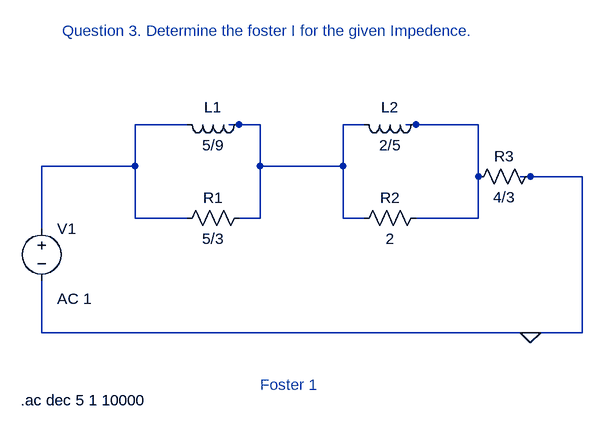
[diagram p0: schematic 3_Dheerendra_23EE019_Network_Synthesis.asc]
3_Dheerendra_23EE019_Network_Synthesis.asc, the LTspice schematic file:
Version 4
SHEET 1 880 680
WIRE 64 112 -16 112
WIRE 144 112 128 112
WIRE 176 112 144 112
WIRE 336 112 304 112
WIRE 416 112 400 112
WIRE 512 112 416 112
WIRE -16 176 -16 112
WIRE -16 176 -160 176
WIRE 176 176 176 112
WIRE 304 176 304 112
WIRE 304 176 176 176
WIRE 512 192 512 112
WIRE 592 192 576 192
WIRE 672 192 592 192
WIRE -16 256 -16 176
WIRE 64 256 -16 256
WIRE 176 256 176 176
WIRE 176 256 144 256
WIRE 304 256 304 176
WIRE 336 256 304 256
WIRE 512 256 512 192
WIRE 512 256 416 256
WIRE -160 272 -160 176
WIRE -160 432 -160 352
WIRE 592 432 -160 432
WIRE 672 432 672 192
WIRE 672 432 592 432
FLAG 592 432 0
SYMBOL voltage -160 256 R0
WINDOW 123 24 124 Left 2
WINDOW 39 0 0 Left 0
SYMATTR InstName V1
SYMATTR Value ""
SYMATTR Value2 AC 1
SYMBOL res 160 240 R90
WINDOW 0 0 56 VBottom 2
WINDOW 3 32 56 VTop 2
SYMATTR InstName R1
SYMATTR Value 5/3
SYMBOL res 432 240 R90
WINDOW 0 0 56 VBottom 2
WINDOW 3 32 56 VTop 2
SYMATTR InstName R2
SYMATTR Value 2
SYMBOL ind 160 96 R90
WINDOW 0 5 56 VBottom 2
WINDOW 3 32 56 VTop 2
SYMATTR InstName L1
SYMATTR Value 5/9
SYMBOL ind 432 96 R90
WINDOW 0 5 56 VBottom 2
WINDOW 3 32 56 VTop 2
SYMATTR InstName L2
SYMATTR Value 2/5
SYMBOL res 608 176 R90
WINDOW 0 0 56 VBottom 2
WINDOW 3 32 56 VTop 2
SYMATTR InstName R3
SYMATTR Value 4/3
TEXT -128 -32 Left 2 ;Question 3. Determine the foster I for the given Impedence.
TEXT 176 512 Left 2 ;Foster 1
TEXT -192 536 Left 2 !.ac dec 5 1 10000

The netlist it stands for:
* 3_Dheerendra_23EE019_Network_Synthesis.asc
V1 N001 0 AC 1
R1 N002 N001 5/3
R2 N003 N002 2
L1 N002 N001 5/9
L2 N003 N002 2/5
R3 0 N003 4/3
* Question 3. Determine the foster I for the given Impedence.
* Foster 1
.ac dec 5 1 10000
.backanno
.end